# EAGLE schematic VisualightMicroBulb_04 (EAGLE 6.2)
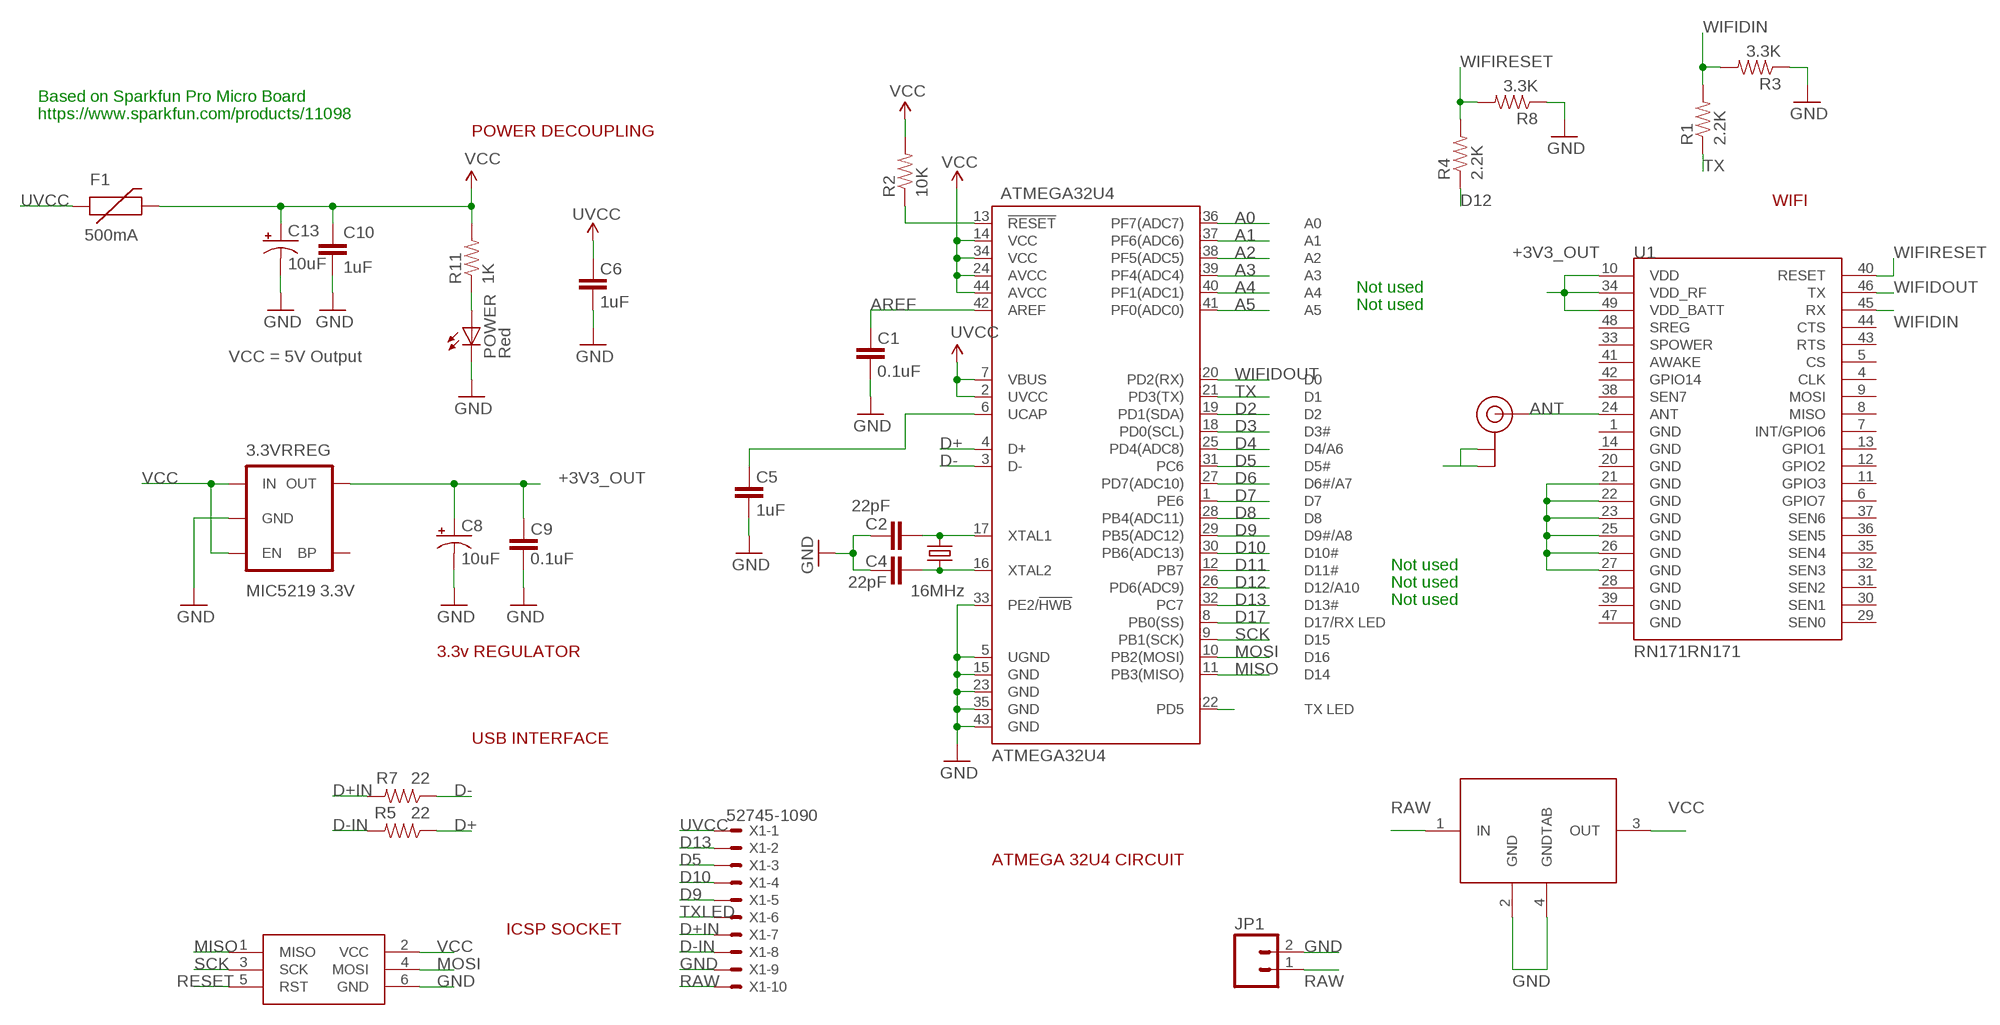
[diagram p0: schematic, sheet 1]

## Parts
3.3VRREG  MIC5219 3.3V  V_REG_MIC52193.3V  [SOT23-5]
ATMEGA32U4  ATMEGA32U4  ATMEGA32U4TQFP  [SPARKFUN-DIGITALIC_TQFP44]
C1  0.1uF  CAP0402-CAP  [0402-CAP]
C2  22pF  CAP0402-CAP  [0402-CAP]
C4  22pF  CAP0402-CAP  [0402-CAP]
C5  1uF  CAP0402-CAP  [0402-CAP]
C6  1uF  CAP0402-CAP  [0402-CAP]
C8  10uF  CAP_POL1206  [EIA3216]
C9  0.1uF  CAP0402-CAP  [0402-CAP]
C10  1uF  CAP0402-CAP  [0402-CAP]
C13  10uF  CAP_POL1206  [EIA3216]
F1  500mA  PTCSMD  [PTC-1206]
ISP1  AVRISP-6  [AVRISP]
JP1  M02PTH  [1X02]
POWER  Red  LED0603  [LED-0603]
R1  2.2K  RESISTOR0402-RES  [0402-RES]
R2  10K  RESISTOR0402-RES  [0402-RES]
R3  3.3K  RESISTOR0402-RES  [0402-RES]
R4  2.2K  RESISTOR0402-RES  [0402-RES]
R5  22  RESISTOR0402-RES  [0402-RES]
R7  22  RESISTOR0402-RES  [0402-RES]
R8  3.3K  RESISTOR0402-RES  [0402-RES]
R11  1K  RESISTOR0402-RES  [0402-RES]
U1  RN171RN171  [RN171]
U$1  U.FL  [U.FL]
U$2  MIC5239  [SOT223]
X1  52745-1090  [52745-1090]
Y1  16MHz  CRYSTAL5X3  [CRYSTAL-SMD-5X3]

## Nets
+3V3_OUT: 3.3VRREG.5(OUT) C8.A(+) C9.2 U1.10(VDD) U1.34(VDD_RF) U1.49(VDD_BATT)
A0: ATMEGA32U4.36(PF7(ADC7))
A1: ATMEGA32U4.37(PF6(ADC6))
A2: ATMEGA32U4.38(PF5(ADC5))
A3: ATMEGA32U4.39(PF4(ADC4))
A4: ATMEGA32U4.40(PF1(ADC1))
A5: ATMEGA32U4.41(PF0(ADC0))
ANT: U1.24(ANT) U$1.P$3(SIGNAL)
AREF: ATMEGA32U4.42(AREF) C1.2
D2: ATMEGA32U4.19(PD1(SDA))
D3: ATMEGA32U4.18(PD0(SCL))
D4: ATMEGA32U4.25(PD4(ADC8))
D5: ATMEGA32U4.31(PC6) X1.3
D6: ATMEGA32U4.27(PD7(ADC10))
D7: ATMEGA32U4.1(PE6)
D8: ATMEGA32U4.28(PB4(ADC11))
D9: ATMEGA32U4.29(PB5(ADC12)) X1.5
D10: ATMEGA32U4.30(PB6(ADC13)) X1.4
D11: ATMEGA32U4.12(PB7)
D12: ATMEGA32U4.26(PD6(ADC9)) R4.1
D13: ATMEGA32U4.32(PC7) X1.2
D17: ATMEGA32U4.8(PB0(SS))
D+: ATMEGA32U4.4(D+) R5.1
D+IN: R7.2 X1.7
D-: ATMEGA32U4.3(D-) R7.1
D-IN: R5.2 X1.8
GND [vcc]: 3.3VRREG.2(GND) ATMEGA32U4.5(UGND) ATMEGA32U4.15(GND) ATMEGA32U4.23(GND) ATMEGA32U4.33(PE2/!HWB) ATMEGA32U4.35(GND) ATMEGA32U4.43(GND) C1.1 C2.2 C4.2 C5.1 C6.1 C8.C(-) C9.1 C10.2 C13.C(-) ISP1.6(GND) JP1.2 POWER.C R3.1 R8.1 U1.21(GND) U1.22(GND) U1.23(GND) U1.25(GND) U1.26(GND) U1.27(GND) U$1.P$1(GND) U$1.P$2(GND) U$2.2(GND) U$2.4(GNDTAB) X1.9
MISO: ATMEGA32U4.11(PB3(MISO)) ISP1.1(MISO)
MOSI: ATMEGA32U4.10(PB2(MOSI)) ISP1.4(MOSI)
N$1: ATMEGA32U4.16(XTAL2) C4.1 Y1.1
N$2: ATMEGA32U4.17(XTAL1) C2.1 Y1.3
N$4: ATMEGA32U4.6(UCAP) C5.2
N$38: POWER.A R11.1
RAW: JP1.1 U$2.1(IN) X1.10
RESET: ATMEGA32U4.13(!RESET) ISP1.5(RST) R2.1
SCK: ATMEGA32U4.9(PB1(SCK)) ISP1.3(SCK)
TX: ATMEGA32U4.21(PD3(TX)) R1.1
TXLED: ATMEGA32U4.22(PD5) X1.6
UVCC: ATMEGA32U4.2(UVCC) ATMEGA32U4.7(VBUS) C6.2 F1.1 X1.1
VCC: 3.3VRREG.1(IN) 3.3VRREG.3(EN) ATMEGA32U4.14(VCC) ATMEGA32U4.24(AVCC) ATMEGA32U4.34(VCC) ATMEGA32U4.44(AVCC) C10.1 C13.A(+) F1.2 ISP1.2(VCC) R2.2 R11.2 U$2.3(OUT)
WIFIDIN: R1.2 R3.2 U1.45(RX)
WIFIDOUT: ATMEGA32U4.20(PD2(RX)) U1.46(TX)
WIFIRESET: R4.2 R8.2 U1.40(RESET)
Unconnected: 3.3VRREG.4(BP) U1.1(GND) U1.4(CLK) U1.5(CS) U1.6(GPIO7) U1.7(INT/GPIO6) U1.8(MISO) U1.9(MOSI) U1.11(GPIO3) U1.12(GPIO2) U1.13(GPIO1) U1.14(GND) U1.20(GND) U1.28(GND) U1.29(SEN0) U1.30(SEN1) U1.31(SEN2) U1.32(SEN3) U1.33(SPOWER) U1.35(SEN4) U1.36(SEN5) U1.37(SEN6) U1.38(SEN7) U1.39(GND) U1.41(AWAKE) U1.42(GPIO14) U1.43(RTS) U1.44(CTS) U1.47(GND) U1.48(SREG)

## Notes on the sheet
- Based on Sparkfun Pro Micro Board
- https://www.sparkfun.com/products/11098
- POWER DECOUPLING
- WIFI
- Not used
- Not used
- VCC = 5V Output
- Not used
- Not used
- Not used
- 3.3v REGULATOR
- USB INTERFACE
- ATMEGA 32U4 CIRCUIT
- ICSP SOCKET

## Library data of the parts
3.3VRREG = SparkFun-PowerIC:V_REG_MIC5219: V_REG MIC5219 Standard 500mA LDO voltage regulator in SOT-23 layout. Micrel part MIC5219. BP (by-pass) pin is used to lower output noise with 470pF cap, may be left open.; PROD_ID: VREG-09872
ATMEGA32U4 = SparkFun-DigitalIC:ATMEGA32U4: Atmel 44-pin 8-bit Microcontroller with 32KBytes of ISP Flash and USB Controller
C1 C2 C4-C6 C9 C10 = SparkFun:CAP: Capacitor Standard 0603 ceramic capacitor, and 0.1" leaded capacitor.
C8 C13 = SparkFun:CAP_POL: Capacitor Polarized These are standard SMD and PTH capacitors. Normally 10uF, 47uF, and 100uF in electrolytic and tantalum varieties. Always verify the external diameter of the through hole cap, it varies with capacity, voltage, and manufacturer. The EIA devices should be standard.
F1 = SparkFun:PTC: Resettable Fuse PTC Resettable Fuse. Spark Fun Electronics SKU : COM-08357
ISP1 = adafruit:AVRISP: AVR ISP HEADER Standard 6 pin header for AVR programming
JP1 = SparkFun-Connectors:M02: Header 2 Standard 2-pin 0.1" header. Use with straight break away headers (SKU : PRT-00116), right angle break away headers (PRT-00553), swiss pins (PRT-00743), machine pins (PRT-00117), and female headers (PRT-00115). Molex polarized connector foot print use with SKU : PRT-08233 with associated crimp pins and housings.
POWER = SparkFun:LED: LEDs Standard schematic elements and footprints for 5mm, 3mm, 1206, and 0603 sized LEDs. 5mm - Spark Fun Electronics SKU : COM-00529 (and others)
R1-R5 R7 R8 R11 = SparkFun:RESISTOR: Resistor Basic schematic elements and footprints for 0603, 1206, and PTH resistors.
U1 = SparkFun-RF:RN171: WiFi Module
U$1 = SparkFun-Connectors:U.FL: SMD antenna connector- WRL-09144
U$2 = v-reg:MIC5239
X1 = con-molex:52745-1090: FFC/FPC-to-Board 0.50mm (.020") SMT Top Contact Right Angle, ZIF, Style Receptacle 52745 / 52435 Source: http://www.molex.com/product/ffc/52745.html; MPN: 52745-1090; OC_FARNELL: unknown; OC_NEWARK: 92M6380
Y1 = SparkFun:CRYSTAL: Crystals Various standard crystals. Proven footprints. Spark Fun Electronics SKU : COM-00534

## Net classes
0 default: width 0.003 mm, drill 0.254 mm, clearance 0.152 mm